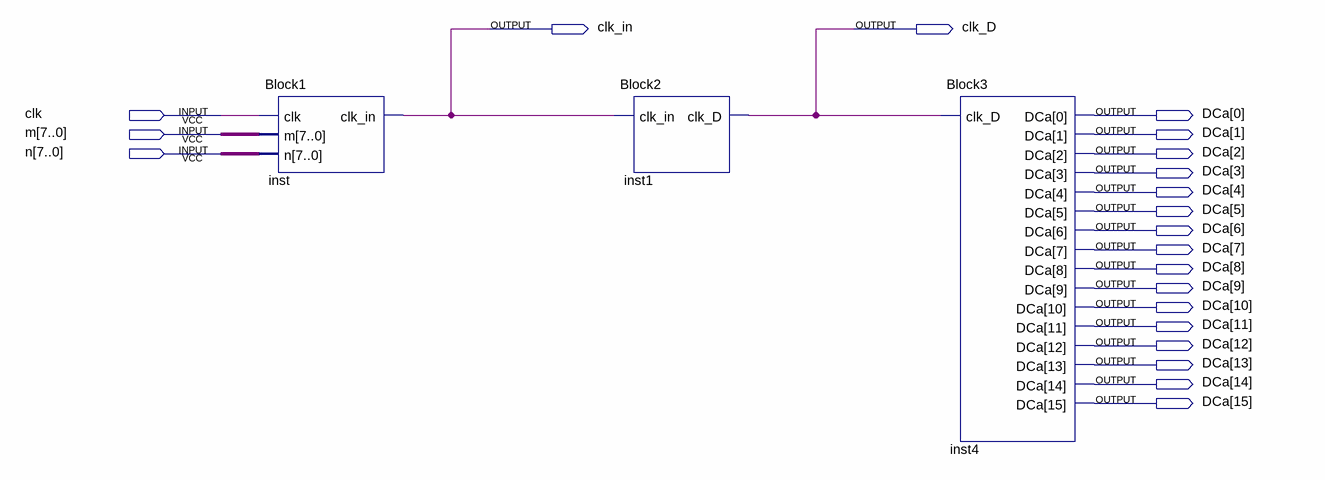
[diagram p0: schematic sheet]
// Quartus schematic Lab2.bdf as structural Verilog: 3 symbols, 21 pins
module Lab2 (
  input  clk,
  input  [7:0] m,
  input  [7:0] n,
  output clk_in,
  output clk_D,
  output [15:0] DCa
);

  Block1 inst (.clk(clk), .m(m), .n(n), .clk_in(clk_in));
  Block2 inst1 (.clk_in(clk_in), .clk_D(clk_D));
  Block3 inst4 (.clk_D(clk_D), .DCa(DCa));
endmodule
